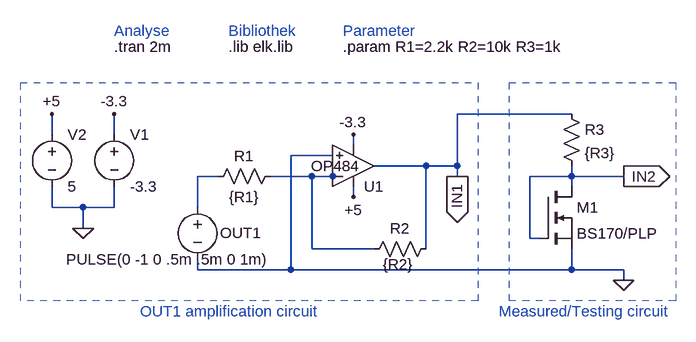
[diagram p0: schematic Draft_nMos-Schaltung_auf_Spice.asc]
Draft_nMos-Schaltung_auf_Spice.asc, the LTspice schematic file:
Version 4
SHEET 1 880 680
WIRE 544 64 368 64
WIRE -256 96 -256 64
WIRE -160 96 -160 64
WIRE 208 112 208 96
WIRE 176 128 112 128
WIRE 320 144 240 144
WIRE 368 144 368 64
WIRE 368 144 320 144
WIRE 0 160 -32 160
WIRE 144 160 80 160
WIRE 176 160 144 160
WIRE 368 160 368 144
WIRE 544 160 544 144
WIRE 544 160 480 160
WIRE 624 160 544 160
WIRE 176 176 176 160
WIRE 544 176 544 160
WIRE 208 192 208 176
WIRE -256 208 -256 176
WIRE -208 208 -256 208
WIRE -160 208 -160 176
WIRE -160 208 -208 208
WIRE -32 208 -32 160
WIRE -208 240 -208 208
WIRE 480 256 480 160
WIRE 496 256 480 256
WIRE 144 272 144 160
WIRE 240 272 144 272
WIRE 320 272 320 144
WIRE -32 304 -32 288
WIRE 112 304 112 128
WIRE 112 304 -32 304
WIRE 544 304 544 272
WIRE 544 304 112 304
WIRE 624 304 544 304
WIRE 624 320 624 304
FLAG 624 320 0
FLAG 208 192 +5
FLAG 208 96 -3.3
FLAG -208 240 0
FLAG -160 64 -3.3
FLAG -256 64 +5
FLAG 368 160 IN1
IOPIN 368 160 Out
FLAG 624 160 IN2
IOPIN 624 160 Out
SYMBOL Opamps\\opamp2 208 208 M180
WINDOW 3 -65 64 Left 2
SYMATTR Value OP484
SYMATTR InstName U1
SYMBOL res 336 256 R90
WINDOW 0 0 56 VBottom 2
WINDOW 3 24 59 VTop 2
SYMATTR InstName R2
SYMATTR Value {R2}
SYMBOL res 528 48 R0
SYMATTR InstName R3
SYMATTR Value {R3}
SYMBOL voltage -160 80 R0
WINDOW 123 0 0 Left 0
WINDOW 39 0 0 Left 0
SYMATTR InstName V1
SYMATTR Value -3.3
SYMBOL voltage -256 80 R0
WINDOW 123 0 0 Left 0
WINDOW 39 0 0 Left 0
SYMATTR InstName V2
SYMATTR Value 5
SYMBOL voltage -32 192 R0
WINDOW 3 -202 96 Left 2
WINDOW 123 0 0 Left 0
WINDOW 39 0 0 Left 0
WINDOW 0 35 55 Left 2
SYMATTR Value PULSE(0 -1 0 .5m .5m 0 1m)
SYMATTR InstName OUT1
SYMBOL res 96 144 R90
WINDOW 0 0 56 VBottom 2
WINDOW 3 32 56 VTop 2
SYMATTR InstName R1
SYMATTR Value {R1}
SYMBOL nmos 496 176 R0
SYMATTR InstName M1
SYMATTR Value BS170/PLP
SYMATTR Prefix XMN
TEXT -120 368 Left 2 ;OUT1 amplification circuit
TEXT 432 368 Left 2 ;Measured/Testing circuit
TEXT -160 -40 Left 2 !.tran 2m
TEXT 16 -40 Left 2 !.lib elk.lib
TEXT 192 -40 Left 2 !.param R1=2.2k R2=10k R3=1k
TEXT -160 -64 Left 2 ;Analyse
TEXT 16 -64 Left 2 ;Bibliothek
TEXT 192 -64 Left 2 ;Parameter
RECTANGLE Normal 400 352 -304 16 1
RECTANGLE Normal 704 352 448 16 1

The netlist it stands for:
* Draft_nMos-Schaltung_auf_Spice.asc
XU1 0 N002 +5 -3.3 IN1 OP484  ; pins In+ In- V+ V- OUT
R2 IN1 N002 {R2}
R3 IN1 IN2 {R3}
V1 -3.3 0 -3.3
V2 +5 0 5
V§OUT1 N001 0 PULSE(0 -1 0 .5m .5m 0 1m)
R1 N002 N001 {R1}
XM1 IN2 IN2 0 BS170/PLP  ; pins D G S
* OUT1 amplification circuit
* Measured/Testing circuit
.tran 2m
.lib elk.lib
.param R1=2.2k R2=10k R3=1k
* Analyse
* Bibliothek
* Parameter
.backanno
.end